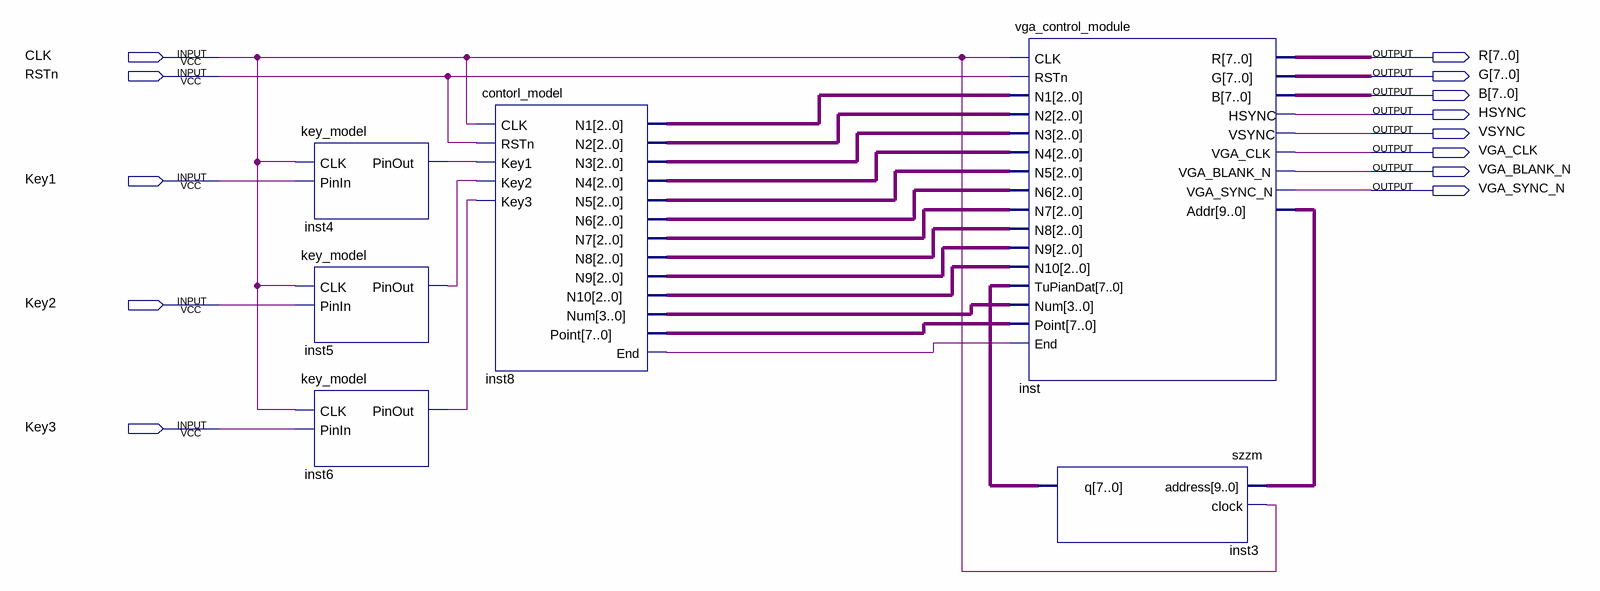
[diagram p0: schematic sheet]
// Quartus schematic top.bdf as structural Verilog: 6 symbols, 13 pins
module top (
  input  CLK,
  input  RSTn,
  input  Key1,
  input  Key2,
  input  Key3,
  output [7:0] R,
  output [7:0] G,
  output [7:0] B,
  output HSYNC,
  output VSYNC,
  output VGA_CLK,
  output VGA_BLANK_N,
  output VGA_SYNC_N
);

  wire inst4_pinout, inst5_pinout, inst6_pinout, inst8_end;
  wire [2:0] inst8_n1, inst8_n2, inst8_n3, inst8_n4, inst8_n5, inst8_n6, inst8_n7, inst8_n8, inst8_n9,
       inst8_n10;
  wire [3:0] inst8_num;
  wire [7:0] inst3_q, inst8_point;
  wire [9:0] inst_addr;

  key_model inst4 (.CLK(CLK), .PinIn(Key1), .PinOut(inst4_pinout));
  key_model inst5 (.CLK(CLK), .PinIn(Key2), .PinOut(inst5_pinout));
  key_model inst6 (.CLK(CLK), .PinIn(Key3), .PinOut(inst6_pinout));
  contorl_model inst8 (
    .CLK(CLK), .RSTn(RSTn), .Key1(inst4_pinout), .Key2(inst5_pinout), .Key3(inst6_pinout), .N1(inst8_n1),
    .N2(inst8_n2), .N3(inst8_n3), .N4(inst8_n4), .N5(inst8_n5), .N6(inst8_n6), .N7(inst8_n7), .N8(inst8_n8),
    .N9(inst8_n9), .N10(inst8_n10), .Num(inst8_num), .Point(inst8_point), .End(inst8_end));
  vga_control_module inst (
    .CLK(CLK), .RSTn(RSTn), .N1(inst8_n1), .N2(inst8_n2), .N3(inst8_n3), .N4(inst8_n4), .N5(inst8_n5),
    .N6(inst8_n6), .N7(inst8_n7), .N8(inst8_n8), .N9(inst8_n9), .N10(inst8_n10), .TuPianDat(inst3_q),
    .Num(inst8_num), .Point(inst8_point), .End(inst8_end), .R(R), .G(G), .B(B), .HSYNC(HSYNC), .VSYNC(VSYNC),
    .VGA_CLK(VGA_CLK), .VGA_BLANK_N(VGA_BLANK_N), .VGA_SYNC_N(VGA_SYNC_N), .Addr(inst_addr));
  szzm inst3 (.address(inst_addr), .clock(CLK), .q(inst3_q));
endmodule
